# Altium project Metlino.PrjPcb (part 6 of 13)

## Sheet PWR_DC_DC_EXAR.SchDoc: Metlino
size 420 x 297 mm; CheckedBy: P.Kulik,T.Przywozki,W.Ruclo; Author: G.Kasprowicz; CompanyName: WUT ISE; DrawnBy: G.Kasprowicz; Organization: WUT ISE; Address1: PW ISE; Address2: Nowowiejska 15/19 00-665 Warsaw; Address3: gkasprow@gmail.com; DocumentNumber: 22; Revision: 2; SheetNumber: 22; SheetTotal: 29; ModifiedBy: -; CheckedDate: -; Title2: FPGA supply buck converters; DivGrp: WUT ISE; Designer: G.Kasprowicz; ModifiedDate: -; ProjectName: Sensor Box
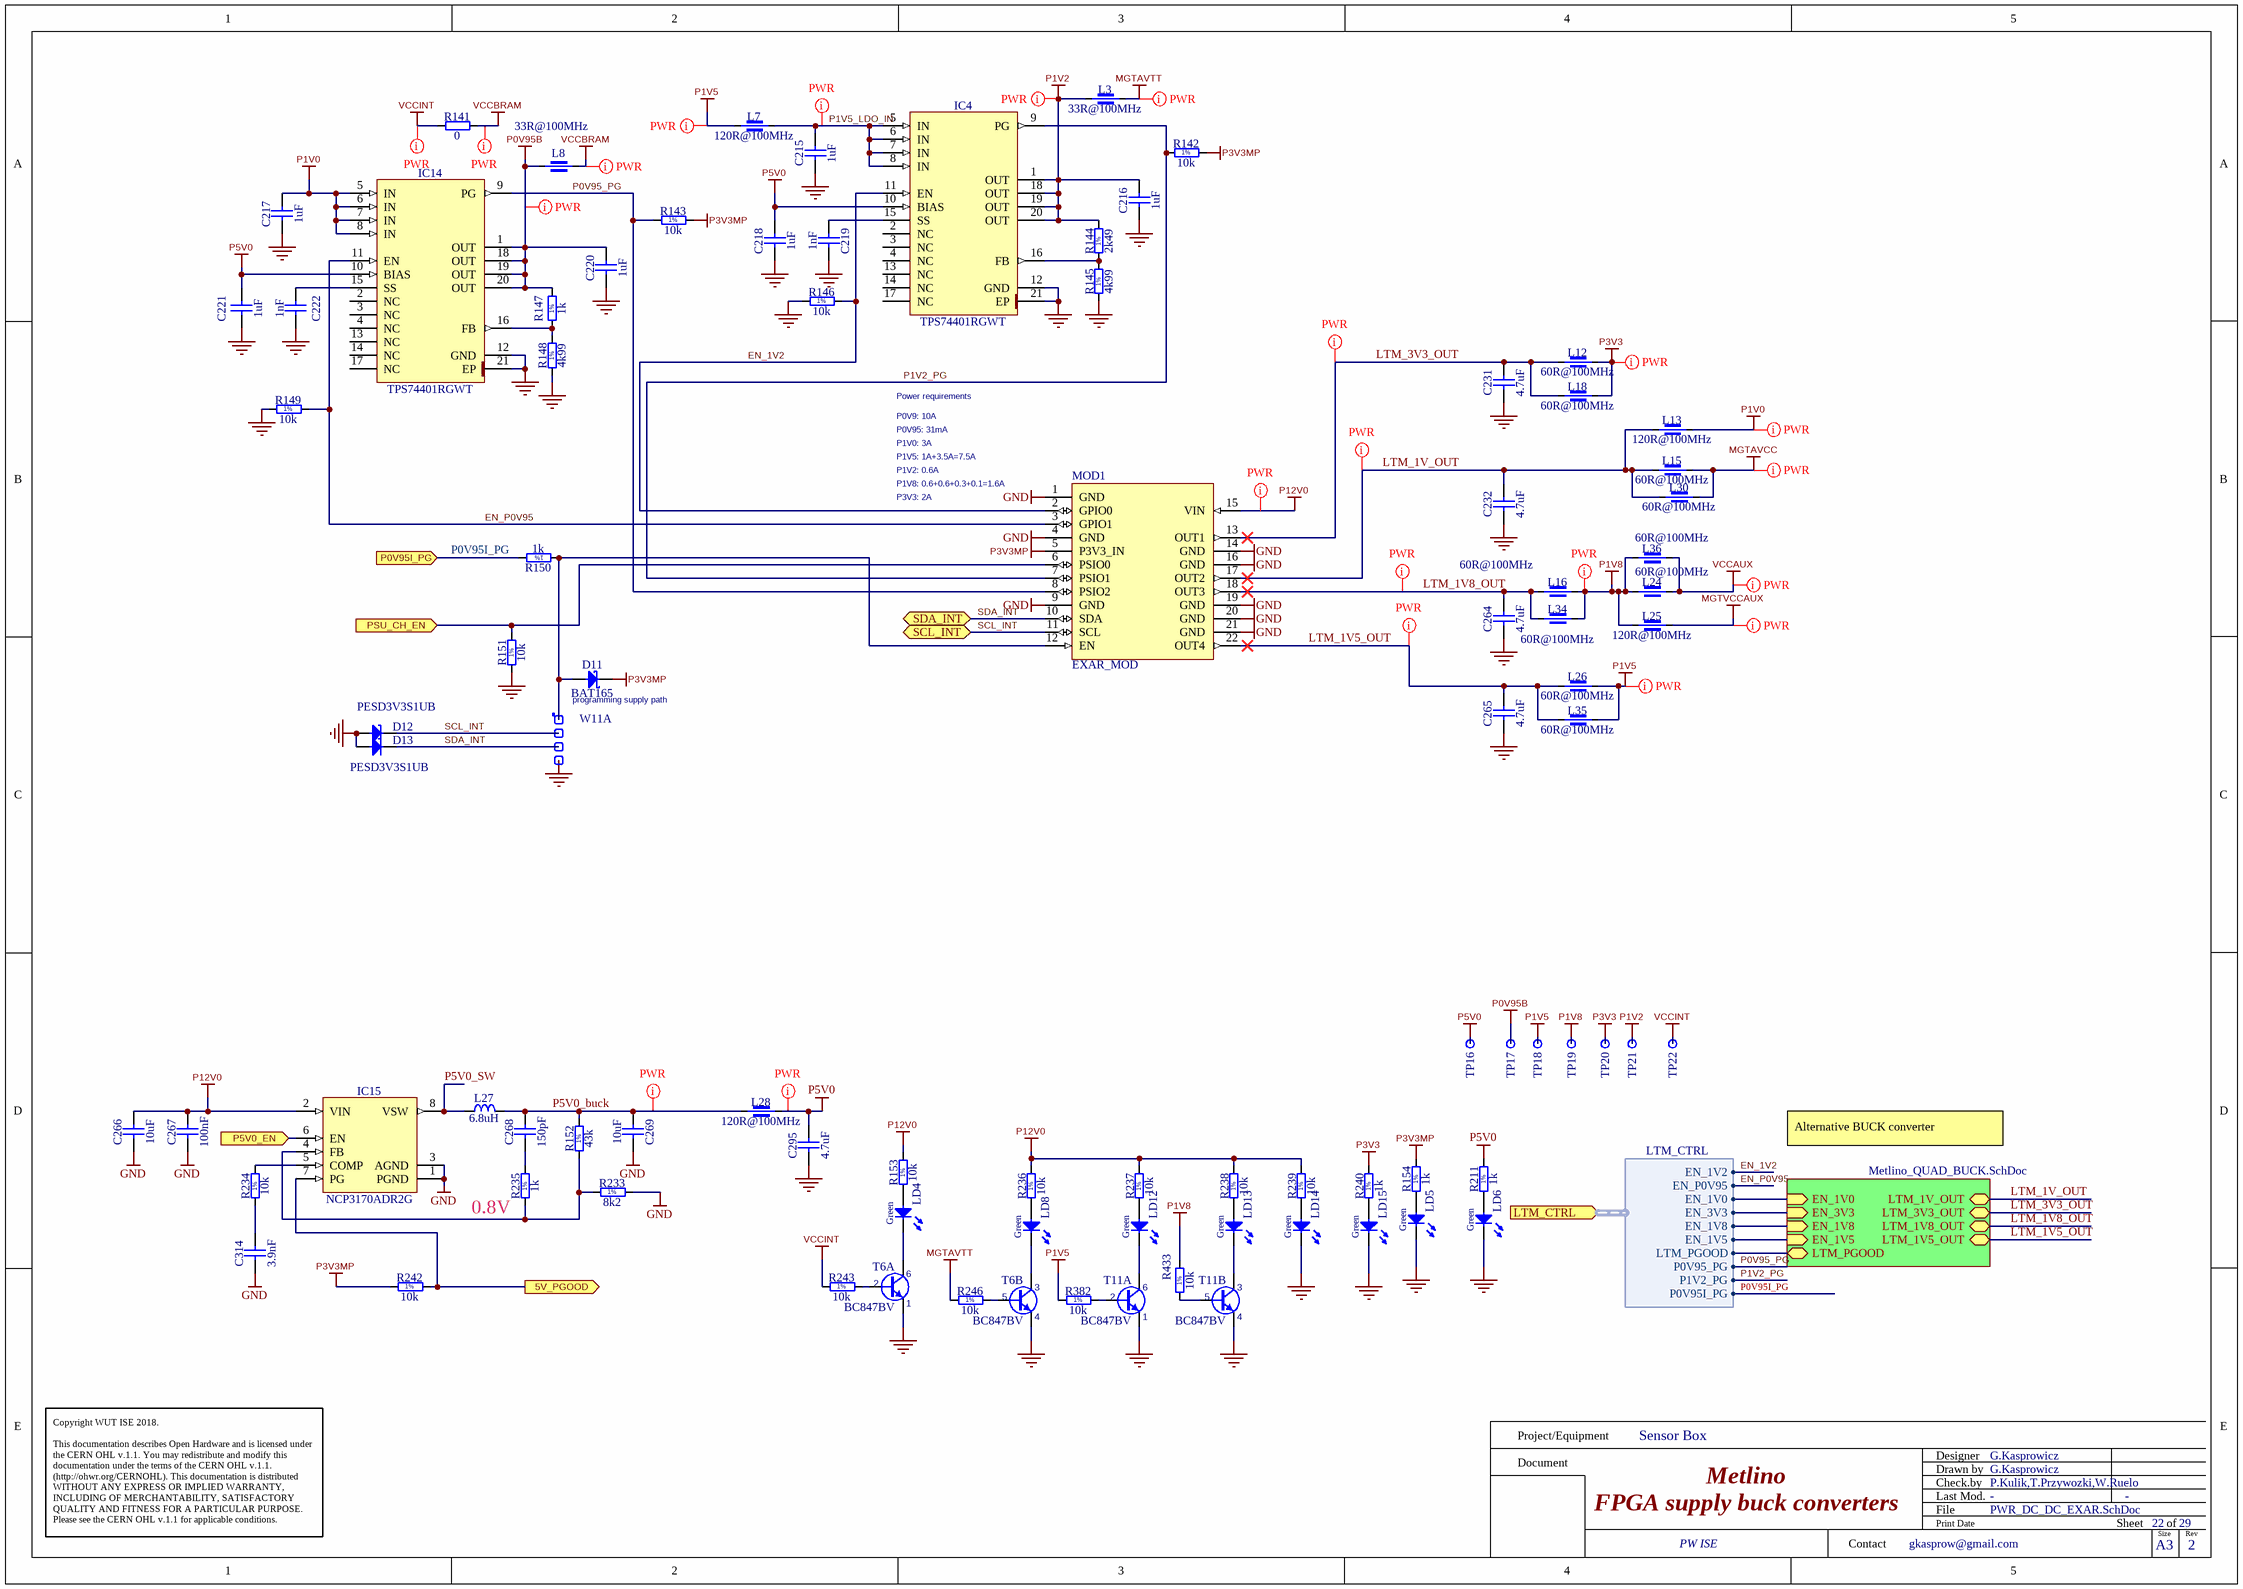
[diagram p10: PWR_DC_DC_EXAR.SchDoc]

### Parts
C215  1uF  [CAPC1005X55N]
C216  1uF  [CAPC1005X55N]
C217  1uF  [CAPC1005X55N]
C218  1uF  [CAPC1005X55N]
C219  1nF  [CAPC1005X55N]
C220  1uF  [CAPC1005X55N]
C221  1uF  [CAPC1005X55N]
C222  1nF  [CAPC1005X55N]
C231  4.7uF  [CAPC1709X95N]
C232  4.7uF  [CAPC1709X95N]
C264  4.7uF  [CAPC1709X95N]
C265  4.7uF  [CAPC1709X95N]
C266  10uF  [CAPC2012X135N]
C267  100nF  [CAPC1005X55N]
C268  150pF  [CAPC1608X87N]
C269  10uF  [CAPC2012X135N]
C295  4.7uF  [CAPC1709X95N]
C314  3.9nF  [CAPC1608X87N]
D11  BAT165  [SOD2512X110N]
D12  PESD3V3S1UB  [SODFL1608X65N]
D13  PESD3V3S1UB  [SODFL1608X65N]
IC4  TPS74401RGWT  [QFN65P500X500X100-21N-S325]
IC14  TPS74401RGWT  [QFN65P500X500X100-21N-S325]
IC15  NCP3170ADR2G  [SOIC127P600X175-8N]
L3  33R@100MHz  [INDC1608X95N]
L7  120R@100MHz  [INDC1608X95N]
L8  33R@100MHz  [INDC1608X95N]
L12  60R@100MHz  [INDC4516X180N]
L13  120R@100MHz  [INDC1608X95N]
L15  60R@100MHz  [INDC4516X180N]
L16  60R@100MHz  [INDC4516X180N]
L18  60R@100MHz  [INDC4516X180N]
L24  60R@100MHz  [INDC4516X180N]
L25  120R@100MHz  [INDC1608X95N]
L26  60R@100MHz  [INDC4516X180N]
L27  6.8uH  [IND_BOURNS_SRU8043]
L28  120R@100MHz  [INDC1608X95N]
L30  60R@100MHz  [INDC4516X180N]
L34  60R@100MHz  [INDC4516X180N]
L35  60R@100MHz  [INDC4516X180N]
L36  60R@100MHz  [INDC4516X180N]
LD4  Green  [LED_KINGBRIGHT_KPH-1608CGCK]
LD5  Green  [LED_KINGBRIGHT_KPH-1608CGCK]
LD6  Green  [LED_KINGBRIGHT_KPH-1608CGCK]
LD8  Green  [LED_KINGBRIGHT_KPH-1608CGCK]
LD12  Green  [LED_KINGBRIGHT_KPH-1608CGCK]
LD13  Green  [LED_KINGBRIGHT_KPH-1608CGCK]
LD14  Green  [LED_KINGBRIGHT_KPH-1608CGCK]
LD15  Green  [LED_KINGBRIGHT_KPH-1608CGCK]
MOD1  EXAR_MOD  [EXAR_MOD]
R141  0  [RESC2012X60N]
R142  10k  [RESC1005X40N]
R143  10k  [RESC1005X40N]
R144  2k49  [RESC1608X55N]
R145  4k99  [RESC1608X55N]
R146  10k  [RESC1005X40N]
R147  1k  [RESC1005X40N]
R148  4k99  [RESC1608X55N]
R149  10k  [RESC1005X40N]
R150  1k  [RESC1005X40N]
R151  10k  [RESC1005X40N]
R152  43k  [RESC1608X55N]
R153  10k  [RESC1005X40N]
R154  1k  [RESC1005X40N]
R211  1k  [RESC1005X40N]
R233  8k2  [RESC1608X55N]
R234  10k  [RESC1005X40N]
R235  1k  [RESC1005X40N]
R236  10k  [RESC1005X40N]
R237  10k  [RESC1005X40N]
R238  10k  [RESC1005X40N]
R239  10k  [RESC1005X40N]
R240  1k  [RESC1005X40N]
R242  10k  [RESC1005X40N]
R243  10k  [RESC1005X40N]
R246  10k  [RESC1005X40N]
R382  10k  [RESC1005X40N]
R433  10k  [RESC1005X40N]
T6  BC847BV  [SOTFL50P160X60-6N]  (parts A,B of 2)
T11  BC847BV  [SOTFL50P160X60-6N]  (parts A,B of 2)
TP16  Test Point  [TPS127]  (value not drawn)
TP17  Test Point  [TPS127]  (value not drawn)
TP18  Test Point  [TPS127]  (value not drawn)
TP19  Test Point  [TPS127]  (value not drawn)
TP20  Test Point  [TPS127]  (value not drawn)
TP21  Test Point  [TPS127]  (value not drawn)
TP22  Test Point  [TPS127]  (value not drawn)
W11  Header 4  [SAMTEC_MTLW-104-07-L-S-250]  (value not drawn)  (parts A,B,C,D of 4)

### Sub-sheets
U_QUAD_BUCK = Metlino_QUAD_BUCK.SchDoc: LTM_1V_OUT (bidir), LTM_1V5_OUT (bidir), EN_1V0 (in), EN_1V5 (in), EN_3V3 (in), EN_1V8 (in), LTM_PGOOD (bidir), LTM_3V3_OUT (bidir), LTM_1V8_OUT (bidir)

### Ports
5V_PGOOD (out), LTM_CTRL (in, harness LTM_CTRL), P0V95I_PG (in), P5V0_EN (in), PSU_CH_EN (in), SCL_INT (bidir), SDA_INT (bidir)

### Harnesses
LTM_CTRL: EN_1V0, EN_3V3, EN_1V8, EN_1V5, LTM_PGOOD, EN_1V2, EN_P0V95, P0V95_PG, P1V2_PG, P0V95I_PG

### Nets
GND: C215.1 C216.1 C217.1 C218.1 C219.2 C220.1 C221.1 C222.2 C231.1 C232.1 C264.1 C265.1 C266.1 C267.1 C269.2 C295.1 C314.1 D12.2(A) D13.2(A) IC4.12(GND) IC4.21(EP) IC14.12(GND) IC14.21(EP) IC15.1(PGND) IC15.3(AGND) LD5.1(C) LD6.1(C) LD14.1(C) LD15.1(C) MOD1.1(GND) MOD1.4(GND) MOD1.9(GND) MOD1.14(GND) MOD1.16(GND) MOD1.19(GND) MOD1.20(GND) MOD1.21(GND) R145.1 R146.1 R148.1 R149.1 R151.1 R233.2 T6.1(E) T6.4(E) T11.1(E) T11.4(E) W11.4
MGTAVCC: L15.2 L30.2
MGTAVTT: L3.2 R246.1
MGTVCCAUX: L25.1
P0V95B: C220.2 IC14.1(OUT) IC14.18(OUT) IC14.19(OUT) IC14.20(OUT) L8.1 R147.2 TP17.1
P1V0: C217.2 IC14.5(IN) IC14.6(IN) IC14.7(IN) IC14.8(IN) L13.1
P1V2: C216.2 IC4.1(OUT) IC4.18(OUT) IC4.19(OUT) IC4.20(OUT) L3.1 R144.2 TP21.1
P1V5: L7.2 L26.2 L35.2 R382.1 TP18.1
P1V8: L16.2 L24.1 L25.2 L34.2 L36.1 R433.2 TP19.1
P3V3: L12.2 L18.2 R240.2 TP20.1
P3V3MP: D11.1(C) MOD1.5(P3V3_IN) R142.2 R143.2 R154.2 R242.1
P5V0: C218.2 C221.2 C295.2 IC4.10(BIAS) IC14.10(BIAS) L28.1 R211.2 TP16.1
P12V0: C266.2 C267.2 IC15.2(VIN) MOD1.15(VIN) R153.2 R236.2 R237.2 R238.2 R239.2
VCCAUX: L24.2 L36.2
VCCBRAM: L8.2 R141.2
VCCINT: R141.1 R243.1 TP22.1
EN_1V0: sheet U_QUAD_BUCK/EN_1V0, port LTM_CTRL.EN_1V0
EN_1V2: IC4.11(EN) MOD1.2(GPIO0) R146.2 ; port LTM_CTRL.EN_1V2
EN_1V5: sheet U_QUAD_BUCK/EN_1V5, port LTM_CTRL.EN_1V5
EN_1V8: sheet U_QUAD_BUCK/EN_1V8, port LTM_CTRL.EN_1V8
EN_3V3: sheet U_QUAD_BUCK/EN_3V3, port LTM_CTRL.EN_3V3
EN_P0V95: IC14.11(EN) MOD1.3(GPIO1) R149.2 ; port LTM_CTRL.EN_P0V95
EN_P5V0: IC15.6(EN) ; port P5V0_EN
EN_PSU_CH: MOD1.6(PSIO0) R151.2 ; port PSU_CH_EN
LTM_1V5_OUT: C265.2 L26.1 L35.1 MOD1.22(OUT4) ; sheet U_QUAD_BUCK/LTM_1V5_OUT
LTM_1V8_OUT: C264.2 L16.1 L34.1 MOD1.18(OUT3) ; sheet U_QUAD_BUCK/LTM_1V8_OUT
LTM_1V_OUT: C232.2 L13.2 L15.1 L30.1 MOD1.17(OUT2) ; sheet U_QUAD_BUCK/LTM_1V_OUT
LTM_3V3_OUT: C231.2 L12.1 L18.1 MOD1.13(OUT1) ; sheet U_QUAD_BUCK/LTM_3V3_OUT
LTM_PGOOD: sheet U_QUAD_BUCK/LTM_PGOOD, port LTM_CTRL.LTM_PGOOD
P0V95_PG: IC14.9(PG) MOD1.8(PSIO2) R143.1 ; port LTM_CTRL.P0V95_PG
P0V95I_PG: R150.2 ; port P0V95I_PG, port LTM_CTRL.P0V95I_PG
P1V2_PG: IC4.9(PG) MOD1.7(PSIO1) R142.1 ; port LTM_CTRL.P1V2_PG
P1V5_LDO_IN: C215.2 IC4.5(IN) IC4.6(IN) IC4.7(IN) IC4.8(IN) L7.1
P5V0_buck: C268.2 C269.1 L27.2 L28.2 R152.2
P5V0_SW: IC15.8(VSW) L27.1
PGOOD_P5V0: IC15.7(PG) R242.2 ; port 5V_PGOOD
SCL_INT: D12.1(C) MOD1.11(SCL) W11.2 ; port SCL_INT  [project net PM_I2C.SCL]
SDA_INT: D13.1(C) MOD1.10(SDA) W11.3 ; port SDA_INT  [project net PM_I2C.SDA]
NetC219_1: C219.1 IC4.15(SS)
NetC222_1: C222.1 IC14.15(SS)
NetC268_1: C268.1 R235.2
NetC314_2: C314.2 R234.1
NetD11_2: D11.2(A) MOD1.12(EN) R150.1 W11.1
NetIC4_16: IC4.16(FB) R144.1 R145.2
NetIC14_16: IC14.16(FB) R147.1 R148.2
NetIC15_4: IC15.4(FB) R152.1 R233.1 R235.1
NetIC15_5: IC15.5(COMP) R234.2
NetLD4_1: LD4.1(C) T6.6(C)
NetLD4_2: LD4.2(A) R153.1
NetLD5_2: LD5.2(A) R154.1
NetLD6_2: LD6.2(A) R211.1
NetLD8_1: LD8.1(C) T6.3(C)
NetLD8_2: LD8.2(A) R236.1
NetLD12_1: LD12.1(C) T11.6(C)
NetLD12_2: LD12.2(A) R237.1
NetLD13_1: LD13.1(C) T11.3(C)
NetLD13_2: LD13.2(A) R238.1
NetLD14_2: LD14.2(A) R239.1
NetLD15_2: LD15.2(A) R240.1
NetR243_2: R243.2 T6.2(B)
NetR246_2: R246.2 T6.5(B)
NetR382_2: R382.2 T11.2(B)
NetR433_1: R433.1 T11.5(B)

Not connected (* = marked no-connect by the designer): IC4 2(NC) 3(NC) 4(NC) 13(NC) 14(NC) 17(NC); IC14 2(NC) 3(NC) 4(NC) 13(NC) 14(NC) 17(NC)

### Layout directives
net class PWR: LTM_1V5_OUT, LTM_1V8_OUT, LTM_1V_OUT, LTM_3V3_OUT, MGTAVCC, MGTAVTT, MGTVCCAUX, P0V95B, P1V0, P1V2, P1V5, P1V5_LDO_IN, P1V8, P3V3, P5V0, P5V0_buck, P12V0, VCCAUX, VCCBRAM, VCCINT

### Notes on the sheet
- Power requirements
- P1V0: 3A
- P0V95: 31mA
- P1V5: 1A+3.5A=7.5A
- P0V9: 10A
- P3V3: 2A
- P1V8: 0.6+0.6+0.3+0.1=1.6A
- P1V2: 0.6A
- programming supply path
- Alternative BUCK converter
- (near R235) 0.8V
- Project/Equipment
- Document
- Designer
- Drawn by
- Check.by
- Copyright WUT ISE 2018.
  This documentation describes Open Hardware and is licensed under the CERN OHL v.1.1. You may redistribute and modify this documentation under the terms of the CERN OHL v.1.1. (http://ohwr.org/CERNOHL). This documentation is distributed WITHOUT ANY EXPRESS OR IMPLIED WARRANTY, INCLUDING OF MERCHANTABILITY, SATISFACTORY QUALITY AND FITNESS FOR A PARTICULAR PURPOSE. Please see the CERN OHL v.1.1 for applicable conditions.
- Contact
- File
- Last Mod.
- Print Date
- Sheet
- Size
- A3
- of
- Rev
- (in symbol R0402_1K_1%_0.0625W_100PPM) 1%
- (in symbol R0402_10K_1%_0.0625W_100PPM) 1%
- (in symbol R0603_2K49_1%_0.063W_50PPM) 1%
- (in symbol R0603_4K99_1%_0.063W_50PPM) 1%
- (in symbol R0603_8K2_1%_0.1W_100PPM) 1%
- (in symbol R0603_43K_1%_0.1W_100PPM) 1%

### Library data of the parts
C215-C218 C220 C221 = CC0402_1UF_16V_10%_X5R: Non-polarised capacitor; Manufacturer: GENERIC; Part Description: SMD Multilayer Chip Ceramic Capacitor; Manufacturer1 Part Number: C1005X5R1C105KT; Tolerance: ±10%; Voltage: 16V; TC: X5R; Manufacturer Part Number: CC0402_1UF_16V_10%_X5R; Part Number: CC0402_1UF_16V_10%_X5R; Value: 1uF; Component Kind: Standard; Component Type: Standard; Pin Count: 2; Status: Preferred; Case: 0402; Mounted: Yes; Socket: No; SMD: Yes; Sense: No; Manufacturer1 Example: TDK; Manufacturer1 ComponentHeight: 0.55mm; HelpURL: \\cern.ch\dfs\Applications\Altium\Datasheets\CC0402_X5R_TDK_C.pdf; Author: CERN DEM JLC; CreateDate: 25.10.2012; LatestRevisionDate: 25.10.2012
C219 C222 = CC0402_1NF_50V_10%_X7R: Non-polarised capacitor; Manufacturer: GENERIC; Part Description: SMD Multilayer Chip Ceramic Capacitor; Manufacturer1 Part Number: 223858715623; Tolerance: ±10%; Voltage: 50V; TC: X7R; Manufacturer Part Number: CC0402_1NF_50V_10%_X7R; Part Number: CC0402_1NF_50V_10%_X7R; Value: 1nF; Component Kind: Standard; Component Type: Standard; Pin Count: 2; Status: Not Recommended; Case: 0402; Mounted: Yes; Socket: No; SMD: Yes; Sense: No; Manufacturer1 Example: PHYCOMP; Manufacturer1 ComponentHeight: 0.55mm; HelpURL: \\cern.ch\dfs\Applications\Altium\Datasheets\CC0402_X7R_PHYCOMP.pdf; Author: CERN DEM JLC; CreateDate: 03.12.2007; LatestRevisionDate: 03.12.2007
C231 C232 C264 C265 C295 = CC0603_4.7UF_16V_10%_X5R: Non-polarised capacitor; Manufacturer: GENERIC; Part Description: SMD Multilayer Chip Ceramic Capacitor; Manufacturer1 Part Number: EMK107ABJ475KA-T; Tolerance: ±10%; Voltage: 16V; TC: X5R; Manufacturer Part Number: CC0603_4.7UF_16V_10%_X5R; Part Number: CC0603_4.7UF_16V_10%_X5R; Value: 4.7uF; Component Kind: Standard; Component Type: Standard; Pin Count: 2; Status: None; Case: 0603; Mounted: Yes; Socket: No; SMD: Yes; Sense: No; Manufacturer1 Example: TAIYO YUDEN; Manufacturer1 ComponentHeight: 0.95mm; HelpURL: \\cern.ch\dfs\Applications\Altium\Datasheets\CC0603_X7R_TAIYO-YUDEN_HIGH-VALUE.pdf; Author: CERN DEM JLC; CreateDate: 16.12.2013; LatestRevisionDate: 16.09.2014
C266 C269 = CC0805_10UF_16V_10%_X5R: Non-polarised capacitor; Part Description: SMD Multilayer Chip Ceramic Capacitor; Manufacturer: GENERIC; Manufacturer1 Part Number: C0805C106K4PAC; Voltage: 16V; TC: X5R; Tolerance: ±10%; Part Number: CC0805_10UF_16V_10%_X5R; Component Kind: Standard; Component Type: Standard; Pin Count: 2; Value: 10uF; Status: Preferred; Manufacturer Part Number: CC0805_10UF_16V_10%_X5R; Case: 0805; Mounted: Yes; Socket: No; SMD: Yes; Sense: No; Manufacturer1 Example: KEMET; Manufacturer1 ComponentHeight: 1.4mm; HelpURL: \\cern.ch\dfs\Applications\Altium\Datasheets\CC1206_X5R_KEMET.pdf; Author: CERN DEM JLC; CreateDate: 03.12.2007; LatestRevisionDate: 03.12.2007
C267 = CC0402_100NF_16V_10%_X5R: Non-polarised capacitor; Part Description: SMD Multilayer Chip Ceramic Capacitor; Manufacturer: GENERIC; Manufacturer1 Part Number: GRM155R61C104KA88D; Voltage: 16V; TC: X5R; Tolerance: ±10%; Part Number: CC0402_100NF_16V_10%_X5R; Component Kind: Standard; Component Type: Standard; Pin Count: 2; Value: 100nF; Status: None; Manufacturer Part Number: CC0402_100NF_16V_10%_X5R; Case: 0402; Mounted: Yes; Socket: No; SMD: Yes; Sense: No; Manufacturer1 Example: MURATA; Manufacturer1 ComponentHeight: 0.55mm; HelpURL: \\cern.ch\dfs\Applications\Altium\Datasheets\CC0402_X5R_MURATA_GRM.pdf; Author: CERN DEM JLC; CreateDate: 10.12.2013; LatestRevisionDate: 10.12.2013
C268 = CC0603_150PF_50V_1%_NP0: Non-polarised capacitor; Part Description: SMD Multilayer Chip Ceramic Capacitor; Manufacturer: GENERIC; Manufacturer1 Part Number: CC0603FRNPO9BN151; Voltage: 50V; TC: C0G/NP0; Tolerance: ±1%; Part Number: CC0603_150PF_50V_1%_NP0; Component Kind: Standard; Component Type: Standard; Pin Count: 2; Value: 150pF; Status: None; Manufacturer Part Number: CC0603_150PF_50V_1%_NP0; Case: 0603; Mounted: Yes; Socket: No; SMD: Yes; Sense: No; Manufacturer1 Example: PHYCOMP; Manufacturer1 ComponentHeight: 0.7mm; HelpURL: \\cern.ch\dfs\Applications\Altium\Datasheets\CC0805_NP0_PHYCOMP_16VTO50V.pdf; Author: CERN DEM MR; CreateDate: 17.02.2016; LatestRevisionDate: 17.02.2016
C314 = CC0603_3.9NF_50V_5%_X7R: Non-polarised capacitor; Part Description: SMD Multilayer Chip Ceramic Capacitor; Manufacturer: GENERIC; Manufacturer1 Part Number: 223858615631; Voltage: 50V; TC: X7R; Tolerance: ±5%; Part Number: CC0603_3.9NF_50V_5%_X7R; Component Kind: Standard; Component Type: Standard; Pin Count: 2; Value: 3.9nF; Status: Preferred; Manufacturer Part Number: CC0603_3.9NF_50V_5%_X7R; Case: 0603; Mounted: Yes; Socket: No; SMD: Yes; Sense: No; Manufacturer1 Example: PHYCOMP; Manufacturer1 ComponentHeight: 0.87mm; HelpURL: \\cern.ch\dfs\Applications\Altium\Datasheets\CC0603_X7R_PHYCOMP.pdf; Author: CERN DEM JLC; CreateDate: 03.12.2007; LatestRevisionDate: 03.12.2007
D11 = BAT165: Schottky Diode; Manufacturer: INFINEON; Part Description: Medium Power AF Schottky Diode; Voltage: 40V; Power: 750mA; PressFit: No; Bonding: No; Manufacturer Part Number: BAT165; PackageDescription: Small Outline Diode (SOD-323), 1.70mm W X 1.25mm L X 1.10mm H body,  IPC Medium Density; Part Number: BAT165; Component Kind: Standard; Component Type: Standard; Device: BAT165; Pin Count: 2; Case: SOD323; Mounted: Yes; Socket: No; SMD: Yes; Sense: No; ComponentHeight: 1.1mm; HelpURL: \\cern.ch\dfs\Applications\Altium\Datasheets\BAT165.pdf; Author: CERN DEM JLC; CreateDate: 12.11.2014; LatestRevisionDate: 12.11.2014
D12 D13 = PESD3V3S1UB: ESD protection diode; Manufacturer: NXP SEMICONDUCTORS; Part Description: ESD protection diode (23kV); Voltage: 3V3; Power: 330W; PressFit: No; Bonding: No; Manufacturer Part Number: PESD3V3S1UB; PackageDescription: Ultra Small Outline Diode Flat Lead (SOD-523), Body; 1.2mm L X 0.8mm W X 0.65mm H, IPC Medium Density; Part Number: PESD3V3S1UB; Component Kind: Standard; Component Type: Standard; Device: PESD3V3S1UB; Pin Count: 2; Case: SOD523; Mounted: Yes; Socket: No; SMD: Yes; Sense: No; ComponentHeight: 0.65mm; HelpURL: \\cern.ch\dfs\Applications\Altium\Datasheets\PESD3V3S1UB.pdf; Author: CERN DEM JLC; CreateDate: 29.11.2012; LatestRevisionDate: 29.11.2012
IC4 IC14 = TPS74401RGWT: Single Output LDO, 3.0A, Adj.(0.8 to 3.3V), Fast Transient Response, Programmable SoftStart; Manufacturer: TEXAS INSTRUMENTS; PressFit: No; Bonding: No; Manufacturer Part Number: TPS74401RGWT; PackageDescription: QFN, 0.65mm pitch,square; 20 pin, 5mm X 5mm X 1mm H body (w/thermal tab 3.25 X 3.25mm),  IPC Medium Density; Part Description: Single Output LDO, 3.0A, Adj.(0.8 to 3.3V), Fast Transient Response, Programmable SoftStart; Part Number: TPS74401RGWT; Component Kind: Standard; Component Type: Standard; Device: TPS74401RGWT; Pin Count: 21; Case: QFN20; Mounted: Yes; Socket: No; SMD: Yes; Sense: No; ComponentHeight: 1mm; HelpURL: \\cern.ch\dfs\Applications\Altium\Datasheets\TPS74401RGWT.pdf; Author: CERN DEM JLC; CreateDate: 02.02.2010; LatestRevisionDate: 02.02.2010
IC15 = NCP3170ADR2G: Synchronous PWM Switching Converter; Manufacturer: ON SEMICONDUCTOR; PressFit: No; Bonding: No; Part Number: NCP3170ADR2G; Component Kind: Standard; Component Type: Standard; Device: NCP3170ADR2G; PackageDescription: SOIC 8, Pitch 1.27mm - Body 4x5mm, IPC Medium Density; Part Description: Synchronous PWM Switching Converter; Manufacturer Part Number: NCP3170ADR2G; Pin Count: 8; Case: SOIC8; Mounted: Yes; Socket: No; SMD: Yes; Sense: No; ComponentHeight: 1.75mm; Author: CERN DEM MR; HelpURL: \\cern.ch\dfs\Applications\Altium\Datasheets\NCP3170ADR2G.pdf; CreateDate: 30.05.2016; LatestRevisionDate: 30.05.2016
L3 L8 = IND0603_MURATA_BLM18PG330SN1D: Manufacturer: MURATA; Part Description: SMD EMIFIL Chip Ferrite Bead; Tolerance: ±25%; Power: 3A; Resistance: 0.025R; Manufacturer Part Number: BLM18PG330SN1D; Part Number: IND0603_MURATA_BLM18PG330SN1D; Value: 33R@100MHz; Component Kind: Standard; Component Type: Standard; Pin Count: 2; Status: None; Case: 0603; Mounted: Yes; Socket: No; SMD: Yes; Sense: No; ComponentHeight: 0.95mm; HelpURL: \\cern.ch\dfs\Applications\Altium\Datasheets\IND0603_MURATA_BLM18P.pdf; Author: CERN DEM JMW; CreateDate: 19.02.2014; LatestRevisionDate: 25.10.2018
L7 L13 L25 L28 = IND0603_MURATA_BLM18PG121SN1D: Manufacturer: MURATA; Part Description: SMD EMIFIL Chip Ferrite Bead; Power: 2A; Resistance: 0.05R; Manufacturer Part Number: BLM18PG121SN1D; Part Number: IND0603_MURATA_BLM18PG121SN1D; Value: 120R@100MHz; Component Kind: Standard; Component Type: Standard; Pin Count: 2; Status: None; Case: 0603; Mounted: Yes; Socket: No; SMD: Yes; Sense: No; ComponentHeight: 0.95mm; HelpURL: \\cern.ch\dfs\Applications\Altium\Datasheets\IND0603_MURATA_BLM18P.pdf; Author: CERN DEM BC; CreateDate: 27.07.2015; LatestRevisionDate: 25.10.2018
L12 L15 L16 L18 L24 L26 L30 L34-L36 = IND1806_MURATA_BLM41PG600SN1L: Manufacturer: MURATA; Part Description: SMD EMI Suppression Chip Ferrite Bead (BLM41P Series); Power: 6A; Resistance: 0.01R; Manufacturer Part Number: BLM41PG600SN1L; Part Number: IND1806_MURATA_BLM41PG600SN1L; Value: 60R@100MHz; Component Kind: Standard; Component Type: Standard; Pin Count: 2; Status: None; Case: 1806; Mounted: Yes; Socket: No; SMD: Yes; Sense: No; ComponentHeight: 1.8mm; HelpURL: \\cern.ch\dfs\Applications\Altium\Datasheets\IND1806_MURATA_BLM41P.pdf; Author: CERN DEM JLC; CreateDate: 02.12.2009; LatestRevisionDate: 02.12.2009
L27 = IND_6.8UH_30%_BOURNS_SRU8043: Inductor; Part Description: Shielded SMD Power Inductor; Manufacturer: BOURNS; Manufacturer Part Number: SRU8043-6R8Y; Power: 3.8A; Resistance: 0.0224R; Tolerance: ±30%; Part Number: IND_6.8UH_30%_BOURNS_SRU8043; Component Kind: Standard; Component Type: Standard; Pin Count: 2; Value: 6.8uH; Status: None; Mounted: Yes; Socket: No; SMD: Yes; Sense: No; ComponentHeight: 4.6mm; HelpURL: \\cern.ch\dfs\Applications\Altium\Datasheets\IND_BOURNS_SRU8043.pdf; Author: CERN DEM JMW; CreateDate: 06.08.2015; LatestRevisionDate: 06.08.2015
LD4-LD6 LD8 LD12-LD15 = LED_KINGBRIGHT_KPH-1608CGCK: LED Green 1C 2A; Part Description: SMD Green LED, Case 1.6mmX0.8mm(0603), 0.65mm Thickness; PressFit: No; Bonding: No; Manufacturer Part Number: KPH-1608CGCK; Manufacturer: KINGBRIGHT; PackageDescription: SMT Green LED, Case 0603, Body L 1.6 x W 0.8mm H 0.65mm; Part Number: LED_KINGBRIGHT_KPH-1608CGCK; Component Kind: Standard; Component Type: Standard; Color: Green; Pin Count: 2; Mounted: Yes; Socket: No; SMD: Yes; Sense: No; ComponentHeight: 0.65mm; HelpURL: \\cern.ch\dfs\Applications\Altium\Datasheets\LED_KINGBRIGHT_KPH-1608CGCK.pdf; Author: CERN DEM JLC; CreateDate: 03.07.2017; LatestRevisionDate: 03.07.2017
MOD1 = DC/DC_EXAR_MOD: 4 channel PCB module based on XRP7724ILB-F
R141 = R0805_0R_JUMPER: Resistor; Part Description: 2A (0.05R Max DC Resistance) Zero Ohm Jumper; Manufacturer: GENERIC; Manufacturer1 Part Number: NRC10Z0; PressFit: No; Part Number: R0805_0R_JUMPER; Component Kind: Standard; Component Type: Standard; Pin Count: 2; Value: 0; Status: Preferred; Manufacturer Part Number: R0805_0R_JUMPER; Case: 0805; Mounted: Yes; Sense: No; Socket: No; SMD: Yes; Manufacturer1 Example: NIC COMPONENT; Manufacturer1 ComponentHeight: 0.6mm; HelpURL: \\cern.ch\dfs\Applications\Altium\Datasheets\R0805_NIC_NRC.pdf; Author: CERN DEM JLC; CreateDate: 03.12.2007; LatestRevisionDate: 13.03.2008
R142 R143 R146 R149 R151 R153 R236-R239 R242 R243 R246 R382 R433 = R0402_10K_1%_0.0625W_100PPM: Resistor - 1%; Manufacturer: GENERIC; Part Description: General Purpose Thick Film Chip Resistor; Manufacturer1 Part Number: 232270671003L; TC: ±100ppm/°C; PressFit: No; Manufacturer Part Number: R0402_10K_1%_0.0625W_100PPM; Part Number: R0402_10K_1%_0.0625W_100PPM; Tolerance: ±1%; Value: 10k; Component Kind: Standard; Component Type: Standard; Pin Count: 2; Status: Not Recommended; Power: 0.0625W; Case: 0402; Mounted: Yes; Sense: No; Socket: No; SMD: Yes; Manufacturer1 Example: YAGEO PHYCOMP; Manufacturer1 ComponentHeight: 0.4mm; HelpURL: \\cern.ch\dfs\Applications\Altium\Datasheets\R0402_Phycomp_RC0402.pdf; Author: CERN DEM JLC; CreateDate: 03.12.2007; LatestRevisionDate: 17.10.2012
R144 = R0603_2K49_1%_0.063W_50PPM: Resistor - 1%; Manufacturer: GENERIC; Part Description: General Purpose Thick Film Chip Resistor; Manufacturer1 Part Number: CPF0603F2K49C1; Power: 0.1W; TC: ±50ppm/°C; PressFit: No; Manufacturer Part Number: R0603_2K49_1%_0.063W_50PPM; Part Number: R0603_2K49_1%_0.063W_50PPM; Tolerance: ±1%; Value: 2k49; Component Kind: Standard; Component Type: Standard; Pin Count: 2; Status: None; Case: 0603; Mounted: Yes; Sense: No; Socket: No; SMD: Yes; Manufacturer1 Example: TYCO NEOHM; Manufacturer1 ComponentHeight: 0.55mm; HelpURL: \\cern.ch\dfs\Applications\Altium\Datasheets\R0603_TYCO_CPF.pdf; Author: CERN DEM JLC; CreateDate: 20.05.2010; LatestRevisionDate: 20.05.2010
R145 R148 = R0603_4K99_1%_0.063W_50PPM: Resistor - 1%; Manufacturer: GENERIC; Part Description: General Purpose Thick Film Chip Resistor; Manufacturer1 Part Number: CPF0603F4K99C1; Power: 0.1W; TC: ±50ppm/°C; PressFit: No; Manufacturer Part Number: R0603_4K99_1%_0.063W_50PPM; Part Number: R0603_4K99_1%_0.063W_50PPM; Tolerance: ±1%; Value: 4k99; Component Kind: Standard; Component Type: Standard; Pin Count: 2; Status: None; Case: 0603; Mounted: Yes; Sense: No; Socket: No; SMD: Yes; Manufacturer1 Example: TYCO NEOHM; Manufacturer1 ComponentHeight: 0.55mm; HelpURL: \\cern.ch\dfs\Applications\Altium\Datasheets\R0603_TYCO_CPF.pdf; Author: CERN DEM JLC; CreateDate: 20.05.2010; LatestRevisionDate: 20.05.2010
R147 R150 R154 R211 R240 = R0402_1K_1%_0.0625W_100PPM: Resistor - 1%; Manufacturer: GENERIC; Part Description: General Purpose Thick Film Chip Resistor; Manufacturer1 Part Number: 232270671002L; TC: ±100ppm/°C; PressFit: No; Manufacturer Part Number: R0402_1K_1%_0.0625W_100PPM; Part Number: R0402_1K_1%_0.0625W_100PPM; Tolerance: ±1%; Value: 1k; Component Kind: Standard; Component Type: Standard; Pin Count: 2; Status: Not Recommended; Power: 0.0625W; Case: 0402; Mounted: Yes; Sense: No; Socket: No; SMD: Yes; Manufacturer1 Example: YAGEO PHYCOMP; Manufacturer1 ComponentHeight: 0.4mm; HelpURL: \\cern.ch\dfs\Applications\Altium\Datasheets\R0402_Phycomp_RC0402.pdf; Author: CERN DEM JLC; CreateDate: 03.12.2007; LatestRevisionDate: 17.10.2012
R152 = R0603_43K_1%_0.1W_100PPM: Resistor - 1%; Part Description: General Purpose Thick Film Chip Resistor; Manufacturer: GENERIC; Manufacturer1 Part Number: NRC06F4302TRF; Power: 0.1W; TC: ±100ppm/°C; PressFit: No; Part Number: R0603_43K_1%_0.1W_100PPM; Component Kind: Standard; Component Type: Standard; Pin Count: 2; Value: 43k; Status: Preferred; Tolerance: ±1%; Manufacturer Part Number: R0603_43K_1%_0.1W_100PPM; Case: 0603; Mounted: Yes; Sense: No; Socket: No; SMD: Yes; Manufacturer1 Example: NIC COMPONENT; Manufacturer1 ComponentHeight: 0.55mm; HelpURL: \\cern.ch\dfs\Applications\Altium\Datasheets\R0603_NIC_NRC.pdf; Author: CERN DEM JLC; CreateDate: 03.12.2007; LatestRevisionDate: 13.03.2008
R233 = R0603_8K2_1%_0.1W_100PPM: Resistor - 1%; Part Description: General Purpose Thick Film Chip Resistor; Manufacturer: GENERIC; Manufacturer1 Part Number: NRC06F8201TRF; Power: 0.1W; TC: ±100ppm/°C; PressFit: No; Part Number: R0603_8K2_1%_0.1W_100PPM; Component Kind: Standard; Component Type: Standard; Pin Count: 2; Value: 8k2; Status: Preferred; Tolerance: ±1%; Manufacturer Part Number: R0603_8K2_1%_0.1W_100PPM; Case: 0603; Mounted: Yes; Sense: No; Socket: No; SMD: Yes; Manufacturer1 Example: NIC COMPONENT; Manufacturer1 ComponentHeight: 0.55mm; HelpURL: \\cern.ch\dfs\Applications\Altium\Datasheets\R0603_NIC_NRC.pdf; Author: CERN DEM JLC; CreateDate: 03.12.2007; LatestRevisionDate: 13.03.2008
R234 = R0402_10K_1%_0.0625W_100PPM: Resistor - 1%; Part Description: General Purpose Thick Film Chip Resistor; Manufacturer: GENERIC; Manufacturer1 Part Number: 232270671003L; TC: ±100ppm/°C; PressFit: No; Part Number: R0402_10K_1%_0.0625W_100PPM; Component Kind: Standard; Component Type: Standard; Pin Count: 2; Value: 10k; Status: Not Recommended; Power: 0.0625W; Tolerance: ±1%; Manufacturer Part Number: R0402_10K_1%_0.0625W_100PPM; Case: 0402; Mounted: Yes; Sense: No; Socket: No; SMD: Yes; Manufacturer1 Example: YAGEO PHYCOMP; Manufacturer1 ComponentHeight: 0.4mm; HelpURL: \\cern.ch\dfs\Applications\Altium\Datasheets\R0402_Phycomp_RC0402.pdf; Author: CERN DEM JLC; CreateDate: 03.12.2007; LatestRevisionDate: 17.10.2012
R235 = R0402_1K_1%_0.0625W_100PPM: Resistor - 1%; Part Description: General Purpose Thick Film Chip Resistor; Manufacturer: GENERIC; Manufacturer1 Part Number: 232270671002L; TC: ±100ppm/°C; PressFit: No; Part Number: R0402_1K_1%_0.0625W_100PPM; Component Kind: Standard; Component Type: Standard; Pin Count: 2; Value: 1k; Status: Not Recommended; Power: 0.0625W; Tolerance: ±1%; Manufacturer Part Number: R0402_1K_1%_0.0625W_100PPM; Case: 0402; Mounted: Yes; Sense: No; Socket: No; SMD: Yes; Manufacturer1 Example: YAGEO PHYCOMP; Manufacturer1 ComponentHeight: 0.4mm; HelpURL: \\cern.ch\dfs\Applications\Altium\Datasheets\R0402_Phycomp_RC0402.pdf; Author: CERN DEM JLC; CreateDate: 03.12.2007; LatestRevisionDate: 17.10.2012
T6 T11 = BC847BV: 45V, 100mA NPN General Purpose Double Transistor; Manufacturer: NXP SEMICONDUCTORS; Part Description: 45V 100mA NPN General Purpose Double Transistor; PressFit: No; Bonding: No; Manufacturer Part Number: BC847BV; PackageDescription: SOTFL (SOT666), 0.50mm, Pitch; 6 Pin, 1.20mm W X 1.60mm L X 0.60mm H Body, IPC Medium Density; Part Number: BC847BV; Component Kind: Standard; Component Type: Standard; Device: BC847BV; Pin Count: 6; Case: SOT666; Mounted: Yes; Socket: No; SMD: Yes; Sense: No; ComponentHeight: 0.6mm; HelpURL: \\cern.ch\dfs\Applications\Altium\Datasheets\BC847BV.pdf; Author: CERN DEM JLC; CreateDate: 01.12.2011; LatestRevisionDate: 01.12.2011
TP16-TP22 = SMD_PAD_1.27X1.27MM: Part Description: 1.27mm x 1.27mm PCB Copper Area (SMD Test Point); Mounted: No; Part Number: SMD_PAD_1.27X1.27MM; Component Kind: Standard (No BOM); Component Type: Standard (No BOM); Pin Count: 1; Family: Test Point; Socket: No; SMD: Yes; Sense: No; Status: None; ComponentHeight: 0mm; HelpURL: Undefined; Author: CERN DEM JLC; CreateDate: 12.01.2008; LatestRevisionDate: 12.01.2008; PackageDescription: 1.27mm x 1.27mm PCB Copper Area (SMD Test Point)
W11 = SAMTEC_MTLW-104-07-L-S-250: 4 Mini Wire-Wrap Contact Strip Header; Manufacturer: SAMTEC; Part Description: 4 Contacts, Pitch 2.54mm, Single Row Through Mount Straight Header (Post Lead = 6.35mm, Tail Lead 3.05mm, Insulator 1.52mm); PressFit: No; Manufacturer Part Number: MTLW-104-07-L-S-250; Part Number: SAMTEC_MTLW-104-07-L-S-250; Component Kind: Standard; Component Type: Standard; Pin Count: 4; Family: Header 4; Mounted: Yes; Socket: No; Sense: No; SMD: No; Status: None; ComponentHeight: 7.87mm; HelpURL: \\cern.ch\dfs\Applications\Altium\Datasheets\SAMTEC_MTLW-104-07-L-S-250.pdf; Author: CERN DEM JLC; CreateDate: 13.12.2012; LatestRevisionDate: 13.12.2012

## Sheet Metlino_QUAD_BUCK.SchDoc: Sayma AMC
size 420 x 297 mm; CheckedBy: P.Kulik,T.Przywozki,W.Ruclo; Author: G.Kasprowicz; CompanyName: WUT ISE; DrawnBy: G.Kasprowicz; Organization: WUT ISE; Address1: PW ISE; Address2: Nowowiejska 15/19 00-665 Warsaw; Address3: gkasprow@gmail.com; DocumentNumber: 15; Revision: 2; SheetNumber: 15; SheetTotal: 29; ModifiedBy: -; CheckedDate: -; Title2: Quad buck converter; DivGrp: WUT ISE; Designer: G.Kasprowicz; ModifiedDate: -; ProjectName: Sensor Box
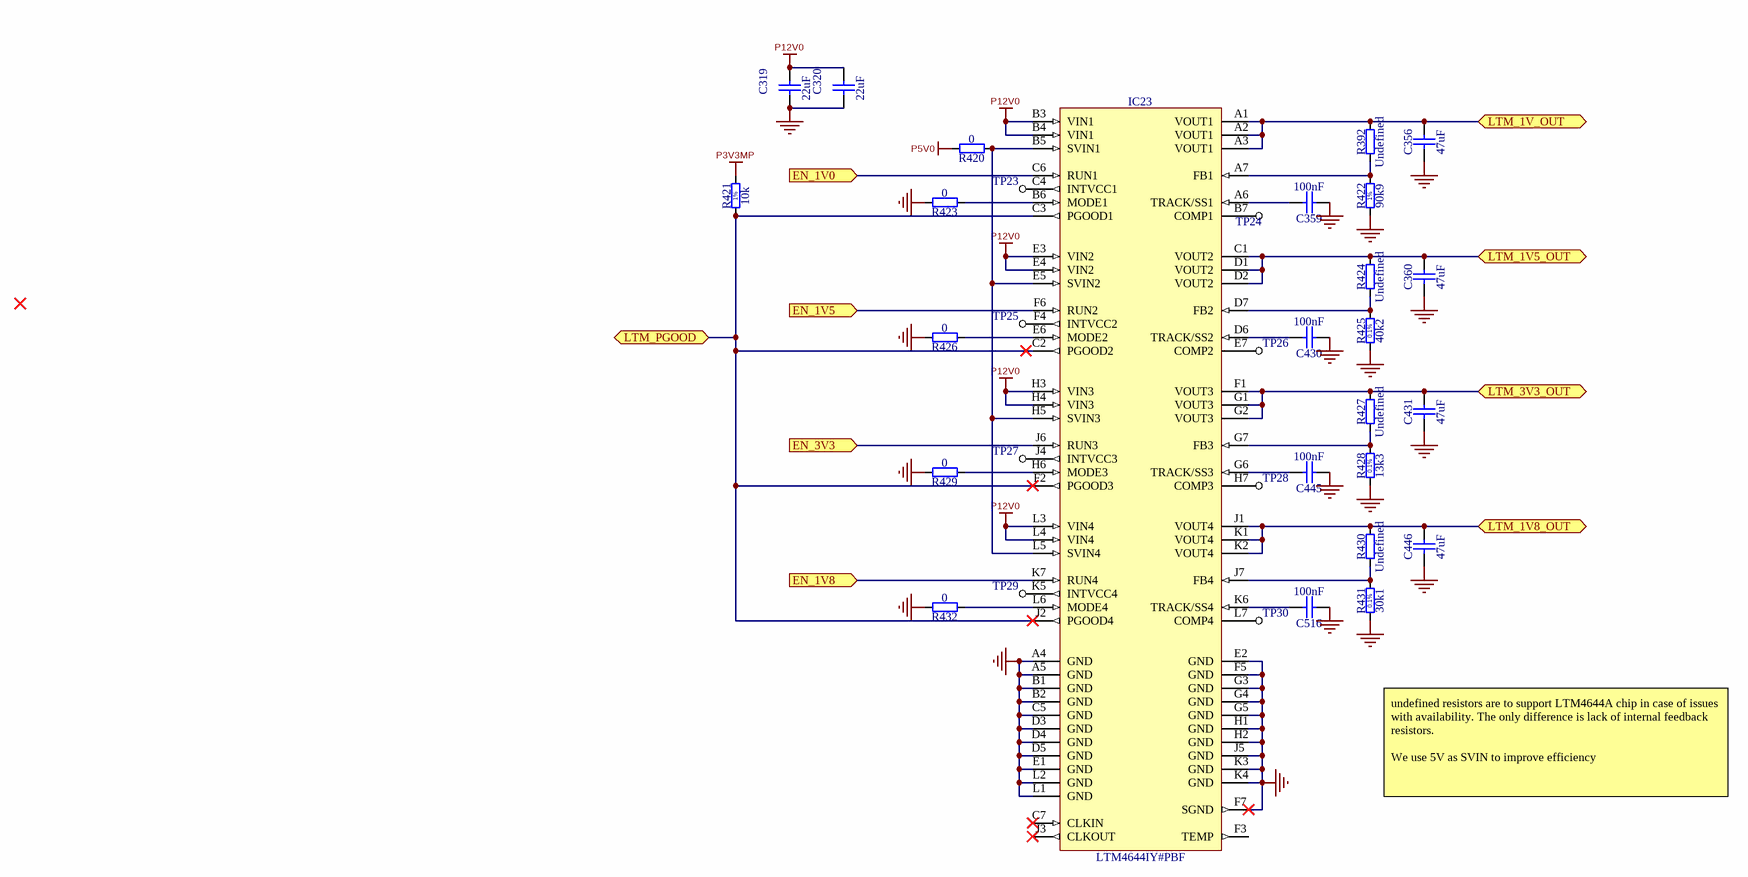
[diagram p11: Metlino_QUAD_BUCK.SchDoc]

### Parts
C319  22uF  [CAPC2012X135N]
C320  22uF  [CAPC2012X135N]
C356  47uF  [CAPC2012X140N]
C359  100nF  [CAPC1005X55N]
C360  47uF  [CAPC2012X140N]
C430  100nF  [CAPC1005X55N]
C431  47uF  [CAPC2012X140N]
C445  100nF  [CAPC1005X55N]
C446  47uF  [CAPC2012X140N]
C516  100nF  [CAPC1005X55N]
IC23  LTM4644IY#PBF  [BGA77C127P7X11_900X1500X521]
R392  Undefined  [RESC1608X55N]
R420  0  [RESC1005X40N]
R421  10k  [RESC1005X40N]
R422  90k9  [RESC1608X55N]
R423  0  [RESC1005X40N]
R424  Undefined  [RESC1608X55N]
R425  40k2  [RESC1608X55N]
R426  0  [RESC1005X40N]
R427  Undefined  [RESC1608X55N]
R428  13k3  [RESC1608X55N]
R429  0  [RESC1005X40N]
R430  Undefined  [RESC1608X55N]
R431  30k1  [RESC1608X55N]
R432  0  [RESC1005X40N]
TP23  TP  [TP]  (value not drawn)
TP24  TP  [TP]  (value not drawn)
TP25  TP  [TP]  (value not drawn)
TP26  TP  [TP]  (value not drawn)
TP27  TP  [TP]  (value not drawn)
TP28  TP  [TP]  (value not drawn)
TP29  TP  [TP]  (value not drawn)
TP30  TP  [TP]  (value not drawn)

### Ports
EN_1V0 (in), EN_1V5 (in), EN_1V8 (in), EN_3V3 (in), LTM_1V5_OUT (bidir), LTM_1V8_OUT (bidir), LTM_1V_OUT (bidir), LTM_3V3_OUT (bidir), LTM_PGOOD (bidir)

### Nets
GND: C319.1 C320.1 C356.1 C359.1 C360.1 C430.1 C431.1 C445.1 C446.1 C516.1 IC23.A4(GND) IC23.A5(GND) IC23.B1(GND) IC23.B2(GND) IC23.C5(GND) IC23.D3(GND) IC23.D4(GND) IC23.D5(GND) IC23.E1(GND) IC23.E2(GND) IC23.F5(GND) IC23.F7(SGND) IC23.G3(GND) IC23.G4(GND) IC23.G5(GND) IC23.H1(GND) IC23.H2(GND) IC23.J5(GND) IC23.K3(GND) IC23.K4(GND) IC23.L1(GND) IC23.L2(GND) R422.1 R423.2 R425.1 R426.2 R428.1 R429.2 R431.1 R432.2
P3V3MP: R421.2
P5V0: R420.2
P12V0: C319.2 C320.2 IC23.B3(VIN1) IC23.B4(VIN1) IC23.E3(VIN2) IC23.E4(VIN2) IC23.H3(VIN3) IC23.H4(VIN3) IC23.L3(VIN4) IC23.L4(VIN4)
EN_1V0: IC23.C6(RUN1) ; port EN_1V0
EN_1V5: IC23.F6(RUN2) ; port EN_1V5
EN_1V8: IC23.K7(RUN4) ; port EN_1V8
EN_3V3: IC23.J6(RUN3) ; port EN_3V3
LTM_1V5_OUT: C360.2 IC23.C1(VOUT2) IC23.D1(VOUT2) IC23.D2(VOUT2) R424.2 ; port LTM_1V5_OUT
LTM_1V8_OUT: C446.2 IC23.J1(VOUT4) IC23.K1(VOUT4) IC23.K2(VOUT4) R430.2 ; port LTM_1V8_OUT
LTM_1V_OUT: C356.2 IC23.A1(VOUT1) IC23.A2(VOUT1) IC23.A3(VOUT1) R392.2 ; port LTM_1V_OUT
LTM_3V3_OUT: C431.2 IC23.F1(VOUT3) IC23.G1(VOUT3) IC23.G2(VOUT3) R427.2 ; port LTM_3V3_OUT
LTM_PGOOD: IC23.C2(PGOOD2) IC23.C3(PGOOD1) IC23.F2(PGOOD3) IC23.J2(PGOOD4) R421.1 ; port LTM_PGOOD
NetC359_2: C359.2 IC23.A6(TRACK/SS1)
NetC430_2: C430.2 IC23.D6(TRACK/SS2)
NetC445_2: C445.2 IC23.G6(TRACK/SS3)
NetC516_2: C516.2 IC23.K6(TRACK/SS4)
NetIC23_A7: IC23.A7(FB1) R392.1 R422.2
NetIC23_B5: IC23.B5(SVIN1) IC23.E5(SVIN2) IC23.H5(SVIN3) IC23.L5(SVIN4) R420.1
NetIC23_B6: IC23.B6(MODE1) R423.1
NetIC23_B7: IC23.B7(COMP1) TP24.1
NetIC23_C4: IC23.C4(INTVCC1) TP23.1
NetIC23_D7: IC23.D7(FB2) R424.1 R425.2
NetIC23_E6: IC23.E6(MODE2) R426.1
NetIC23_E7: IC23.E7(COMP2) TP26.1
NetIC23_F4: IC23.F4(INTVCC2) TP25.1
NetIC23_G7: IC23.G7(FB3) R427.1 R428.2
NetIC23_H6: IC23.H6(MODE3) R429.1
NetIC23_H7: IC23.H7(COMP3) TP28.1
NetIC23_J4: IC23.J4(INTVCC3) TP27.1
NetIC23_J7: IC23.J7(FB4) R430.1 R431.2
NetIC23_K5: IC23.K5(INTVCC4) TP29.1
NetIC23_L6: IC23.L6(MODE4) R432.1
NetIC23_L7: IC23.L7(COMP4) TP30.1

Not connected (* = marked no-connect by the designer): IC23 C7(CLKIN)* F3(TEMP) J3(CLKOUT)*

### Notes on the sheet
- undefined resistors are to support LTM4644A chip in case of issues with availability. The only difference is lack of internal feedback resistors.
  We use 5V as SVIN to improve efficiency
- Project/Equipment
- Document
- Designer
- Drawn by
- Check.by
- Copyright WUT ISE 2018.
  This documentation describes Open Hardware and is licensed under the CERN OHL v.1.1. You may redistribute and modify this documentation under the terms of the CERN OHL v.1.1. (http://ohwr.org/CERNOHL). This documentation is distributed WITHOUT ANY EXPRESS OR IMPLIED WARRANTY, INCLUDING OF MERCHANTABILITY, SATISFACTORY QUALITY AND FITNESS FOR A PARTICULAR PURPOSE. Please see the CERN OHL v.1.1 for applicable conditions.
- Contact
- File
- Last Mod.
- Print Date
- Sheet
- Size
- A3
- of
- Rev
- (in symbol R0402_10K_1%_0.0625W_100PPM) 1%
- (in symbol R0603_13K3_0.1%_0.063W_10PPM) 0.1%
- (in symbol R0603_30K1_0.1%_0.063W_10PPM) 0.1%
- (in symbol R0603_40K2_0.1%_0.063W_10PPM) 0.1%
- (in symbol R0603_90K9_1%_0.1W_100PPM) 1%

### Library data of the parts
C319 C320 = CC0805_22UF_16V_10%_X5R: Non-polarised capacitor; Manufacturer: GENERIC; Part Description: SMD Multilayer Chip Ceramic Capacitor; Manufacturer1 Part Number: C2012X5R1C226KT; Tolerance: ±10%; Voltage: 16V; TC: X5R; Manufacturer Part Number: CC0805_22UF_16V_10%_X5R; Part Number: CC0805_22UF_16V_10%_X5R; Value: 22uF; Component Kind: Standard; Component Type: Standard; Pin Count: 2; Status: Preferred; Case: 0805; Mounted: Yes; Socket: No; SMD: Yes; Sense: No; Manufacturer1 Example: TDK; Manufacturer1 ComponentHeight: 1.35mm; HelpURL: \\cern.ch\dfs\Applications\Altium\Datasheets\CC0805_X5R_TDK_C.pdf; Author: CERN DEM JLC; CreateDate: 25.10.2012; LatestRevisionDate: 25.10.2012
C356 C360 C431 C446 = CC0805_47UF_6.3V_20%_X5R: Non-polarised capacitor; Manufacturer: GENERIC; Part Description: SMD Multilayer Chip Ceramic Capacitor; Manufacturer1 Part Number: C0805C476M9PACTU; Tolerance: ±20%; Voltage: 6.3V; TC: X5R; Manufacturer Part Number: CC0805_47UF_6.3V_20%_X5R; Part Number: CC0805_47UF_6.3V_20%_X5R; Value: 47uF; Component Kind: Standard; Component Type: Standard; Pin Count: 2; Status: Preferred; Case: 0805; Mounted: Yes; Socket: No; SMD: Yes; Sense: No; Manufacturer1 Example: KEMET; Manufacturer1 ComponentHeight: 1.4mm; HelpURL: \\cern.ch\dfs\Applications\Altium\Datasheets\CC0805_X5R_KEMET.pdf; Author: CERN DEM JLC; CreateDate: 16.10.2012; LatestRevisionDate: 16.10.2012
C359 C430 C445 C516 = CC0402_100NF_16V_10%_X5R: as C267 on sheet PWR_DC_DC_EXAR; Part Number: CC0402_100NF_16V_10%_X5R; Component Kind: Standard; Component Type: Standard; Pin Count: 2; Value: 100nF; Status: None; Manufacturer Part Number: CC0402_100NF_16V_10%_X5R; Case: 0402; Mounted: Yes; Socket: No; SMD: Yes; Sense: No; Manufacturer1 Example: MURATA; Manufacturer1 ComponentHeight: 0.55mm; HelpURL: \\cern.ch\dfs\Applications\Altium\Datasheets\CC0402_X5R_MURATA_GRM.pdf; Author: CERN DEM JLC; CreateDate: 10.12.2013; LatestRevisionDate: 10.12.2013
IC23 = LTM4644IY#PBF: Quad DC/DC µModule Regulator with Configurable 4A Output Array; Part Description: 4V-14V to 0.6V-5.5V Quad DC/DC uModule (Power Module) Regulator with Configurable 4A Output Array; Manufacturer: LINEAR TECHNOLOGY; PressFit: No; Bonding: No; Part Number: LTM4644IY#PBF; Component Kind: Standard; Component Type: Standard; Device: LTM4644IY#PBF; PackageDescription: BGA, 1.27mm Pitch, Rect.; 77 Pin, 7 Columns X 11 Rows, 9.00mm X 15.00mm X 5.21mm H; Manufacturer Part Number: LTM4644IY#PBF; Pin Count: 77; Case: BGA77; Mounted: Yes; Socket: No; SMD: Yes; Sense: No; ComponentHeight: 5.21mm; HelpURL: \\cern.ch\dfs\Applications\Altium\Datasheets\LTM4644IY#PBF.pdf; Author: CERN DEM JLC; CreateDate: 25.04.2018; LatestRevisionDate: 25.04.2018
R392 R424 R427 R430 = R0603_NO-VALUE: Resistor; Part Description: Reserved Footprint For a 0603 (1608) Chip Resistor; PressFit: No; Mounted: No; Part Number: R0603_NO-VALUE; Component Kind: Standard; Component Type: Standard; Pin Count: 2; Value: Undefined; Status: None; Manufacturer: Undefined; Manufacturer Part Number: R0603_NO-VALUE; Case: 0603; Sense: No; Socket: No; SMD: Yes; Manufacturer1 Example: Undefined; Manufacturer1 Part Number: Undefined; Manufacturer1 ComponentHeight: Undefined; HelpURL: Undefined; Author: CERN DEM JLC; CreateDate: 03.12.2007; LatestRevisionDate: 13.03.2008
R420 R423 R426 R429 R432 = R0402_0R_JUMPER: Resistor; Manufacturer: GENERIC; Part Description: 1A (0.05R Max DC Resistance) Zero Ohm Jumper; Manufacturer1 Part Number: 232270591001L; PressFit: No; Manufacturer Part Number: R0402_0R_JUMPER; Part Number: R0402_0R_JUMPER; Value: 0; Component Kind: Standard; Component Type: Standard; Pin Count: 2; Status: Not Recommended; Case: 0402; Mounted: Yes; Sense: No; Socket: No; SMD: Yes; Manufacturer1 Example: YAGEO PHYCOMP; Manufacturer1 ComponentHeight: 0.4mm; HelpURL: \\cern.ch\dfs\Applications\Altium\Datasheets\R0402_Phycomp_RC0402.pdf; Author: CERN DEM JLC; CreateDate: 03.12.2007; LatestRevisionDate: 17.10.2012
R421 = R0402_10K_1%_0.0625W_100PPM: as R142 on sheet PWR_DC_DC_EXAR; Manufacturer Part Number: R0402_10K_1%_0.0625W_100PPM; Part Number: R0402_10K_1%_0.0625W_100PPM; Tolerance: ±1%; Value: 10k; Component Kind: Standard; Component Type: Standard; Pin Count: 2; Status: Not Recommended; Power: 0.0625W; Case: 0402; Mounted: Yes; Sense: No; Socket: No; SMD: Yes; Manufacturer1 Example: YAGEO PHYCOMP; Manufacturer1 ComponentHeight: 0.4mm; HelpURL: \\cern.ch\dfs\Applications\Altium\Datasheets\R0402_Phycomp_RC0402.pdf; Author: CERN DEM JLC; CreateDate: 03.12.2007; LatestRevisionDate: 17.10.2012
R422 = R0603_90K9_1%_0.1W_100PPM: Resistor - 1%; Part Description: General Purpose Thick Film Chip Resistor; Manufacturer: GENERIC; Manufacturer1 Part Number: CRCW060390K9FKEA; Power: 0.1W; TC: ±100ppm/°C; PressFit: No; Part Number: R0603_90K9_1%_0.1W_100PPM; Component Kind: Standard; Component Type: Standard; Pin Count: 2; Value: 90k9; Status: Preferred; Tolerance: ±1%; Manufacturer Part Number: R0603_90K9_1%_0.1W_100PPM; Case: 0603; Mounted: Yes; Sense: No; Socket: No; SMD: Yes; Manufacturer1 Example: VISHAY; Manufacturer1 ComponentHeight: 0.55mm; HelpURL: \\cern.ch\dfs\Applications\Altium\Datasheets\R0603_VISHAY_CRCW e3.pdf; Author: CERN DEM JLC; CreateDate: 14.03.2018; LatestRevisionDate: 14.03.2018
R425 = R0603_40K2_0.1%_0.063W_10PPM: Resistor - 0.1%; Part Description: Thin Film Chip Resistor; Manufacturer: GENERIC; Manufacturer1 Part Number: RN73C1J40K2BTDF; Power: 0.063W; TC: ±10ppm; PressFit: No; Part Number: R0603_40K2_0.1%_0.063W_10PPM; Component Kind: Standard; Component Type: Standard; Pin Count: 2; Value: 40k2; Status: Not Recommended; Tolerance: ±0.1%; Manufacturer Part Number: R0603_40K2_0.1%_0.063W_10PPM; Case: 0603; Mounted: Yes; Sense: No; Socket: No; SMD: Yes; Manufacturer1 Example: TYCO HOLSWORTHY; Manufacturer1 ComponentHeight: 0.5mm; HelpURL: \\cern.ch\dfs\Applications\Altium\Datasheets\R0603_Tyco_RN73.pdf; Author: CERN DEM JLC; CreateDate: 03.12.2007; LatestRevisionDate: 13.03.2008
R428 = R0603_13K3_0.1%_0.063W_10PPM: Resistor - 0.1%; Part Description: Thin Film Chip Resistor; Manufacturer: GENERIC; Manufacturer1 Part Number: RN73C1J13K3BTDF; Power: 0.063W; TC: ±10ppm; PressFit: No; Part Number: R0603_13K3_0.1%_0.063W_10PPM; Component Kind: Standard; Component Type: Standard; Pin Count: 2; Value: 13k3; Status: Not Recommended; Tolerance: ±0.1%; Manufacturer Part Number: R0603_13K3_0.1%_0.063W_10PPM; Case: 0603; Mounted: Yes; Sense: No; Socket: No; SMD: Yes; Manufacturer1 Example: TYCO HOLSWORTHY; Manufacturer1 ComponentHeight: 0.5mm; HelpURL: \\cern.ch\dfs\Applications\Altium\Datasheets\R0603_Tyco_RN73.pdf; Author: CERN DEM JLC; CreateDate: 03.12.2007; LatestRevisionDate: 13.03.2008
R431 = R0603_30K1_0.1%_0.063W_10PPM: Resistor - 0.1%; Part Description: Thin Film Chip Resistor; Manufacturer: GENERIC; Manufacturer1 Part Number: RN73C1J30K1BTDF; Power: 0.063W; TC: ±10ppm; PressFit: No; Part Number: R0603_30K1_0.1%_0.063W_10PPM; Component Kind: Standard; Component Type: Standard; Pin Count: 2; Value: 30k1; Status: Not Recommended; Tolerance: ±0.1%; Manufacturer Part Number: R0603_30K1_0.1%_0.063W_10PPM; Case: 0603; Mounted: Yes; Sense: No; Socket: No; SMD: Yes; Manufacturer1 Example: TYCO HOLSWORTHY; Manufacturer1 ComponentHeight: 0.5mm; HelpURL: \\cern.ch\dfs\Applications\Altium\Datasheets\R0603_Tyco_RN73.pdf; Author: CERN DEM JLC; CreateDate: 03.12.2007; LatestRevisionDate: 13.03.2008
TP23-TP30 = TP: Testpoint

## Sheet MCH_CON.SchDoc: Metlino
size 420 x 297 mm; CheckedBy: P.Kulik,T.Przywozki,W.Ruclo; Author: G.Kasprowicz; CompanyName: WUT ISE; DrawnBy: G.Kasprowicz; Organization: WUT ISE; Address1: PW ISE; Address2: Nowowiejska 15/19 00-665 Warsaw; Address3: gkasprow@gmail.com; DocumentNumber: 15; Revision: 2; SheetNumber: 15; SheetTotal: 29; ModifiedBy: -; CheckedDate: -; Title2: MCH Tongue 3&4 connectors; DivGrp: WUT ISE; Designer: G.Kasprowicz; ModifiedDate: -; ProjectName: Sensor Box
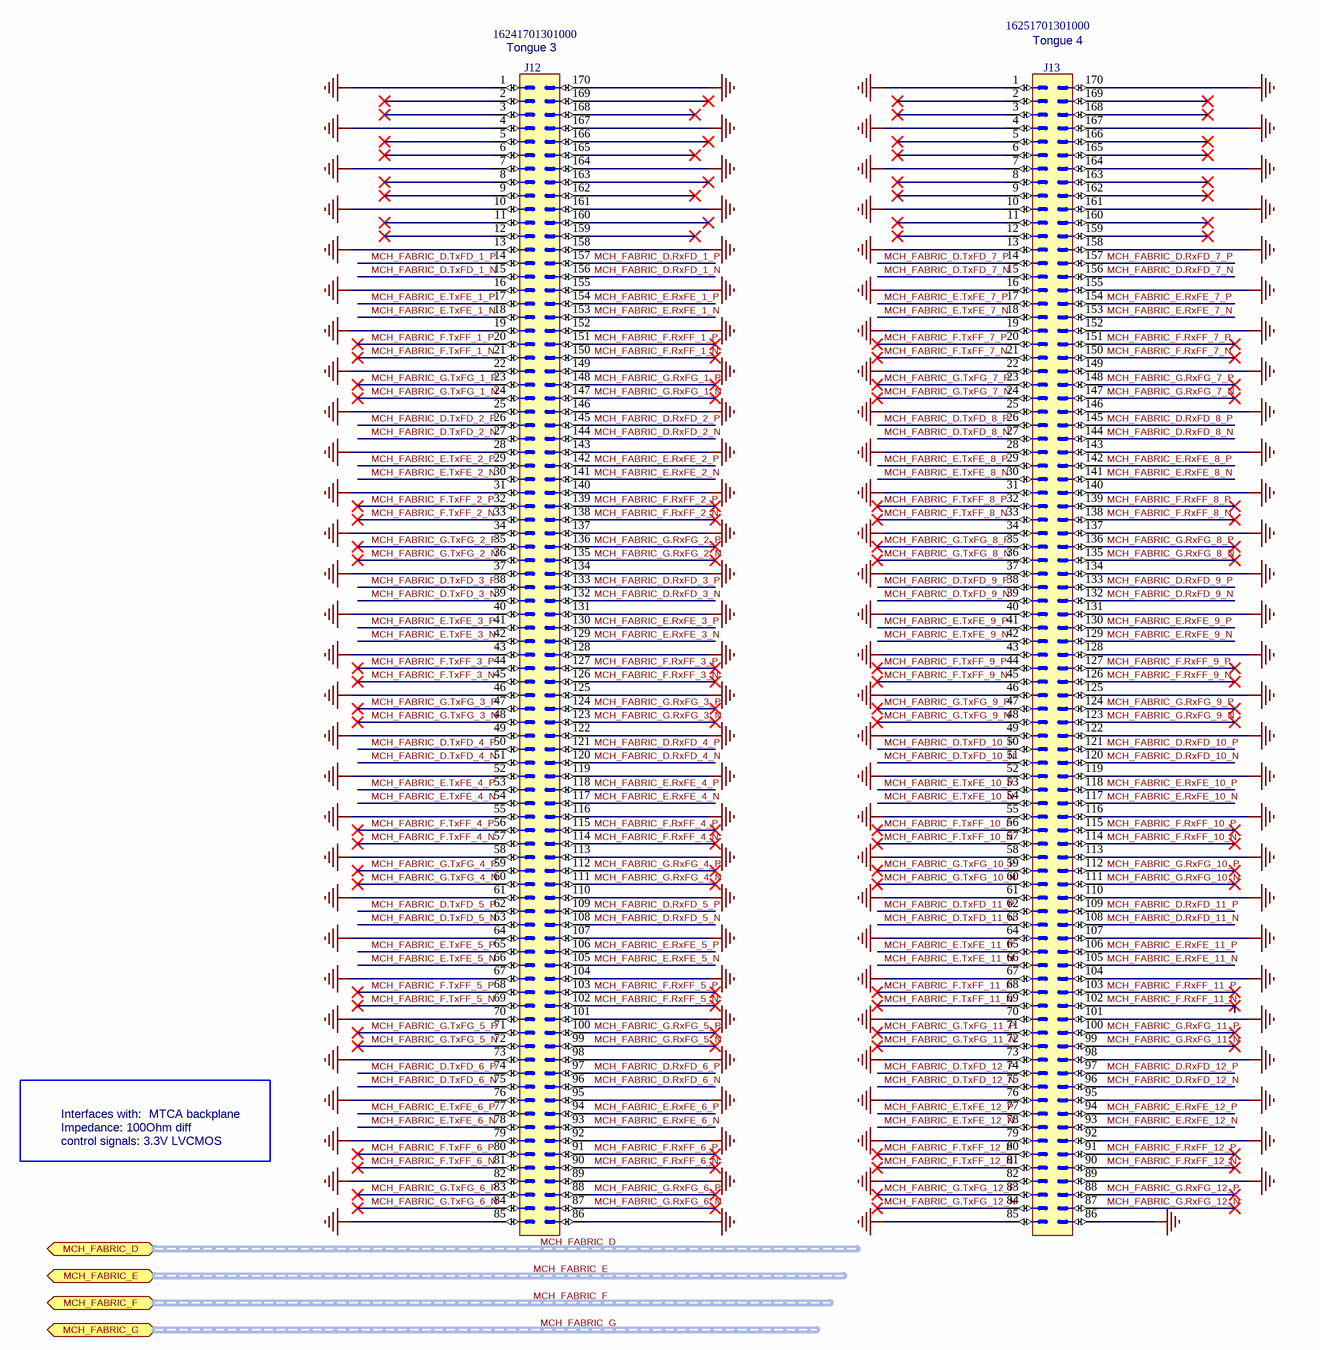
[diagram p12: MCH_CON.SchDoc]

### Parts
J12  Manufacturer Part Number: 16241701301000  [ITB_16241701301000]  (hidden comment: AdvancedMC)
J13  Manufacturer Part Number: 16251701301000  [ITB_16251701301000]  (hidden comment: AdvancedMC)

### Ports
MCH_FABRIC_D (bidir, harness MCH_FABRIC_D), MCH_FABRIC_E (bidir, harness MCH_FABRIC_E), MCH_FABRIC_F (bidir, harness MCH_FABRIC_F), MCH_FABRIC_G (bidir, harness MCH_FABRIC_G)

### Nets
GND: J12.1 J12.4 J12.7 J12.10 J12.13 J12.16 J12.19 J12.22 J12.25 J12.28 J12.31 J12.34 J12.37 J12.40 J12.43 J12.46 J12.49 J12.52 J12.55 J12.58 J12.61 J12.64 J12.67 J12.70 J12.73 J12.76 J12.79 J12.82 J12.85 J12.86 J12.89 J12.92 J12.95 J12.98 J12.101 J12.104 J12.107 J12.110 J12.113 J12.116 J12.119 J12.122 J12.125 J12.128 J12.131 J12.134 J12.137 J12.140 J12.143 J12.146 J12.149 J12.152 J12.155 J12.158 J12.161 J12.164 J12.167 J12.170 J13.1 J13.4 J13.7 J13.10 J13.13 J13.16 J13.19 J13.22 J13.25 J13.28 J13.31 J13.34 J13.37 J13.40 J13.43 J13.46 J13.49 J13.52 J13.55 J13.58 J13.61 J13.64 J13.67 J13.70 J13.73 J13.76 J13.79 J13.82 J13.85 J13.86 J13.89 J13.92 J13.95 J13.98 J13.101 J13.104 J13.107 J13.110 J13.113 J13.116 J13.119 J13.122 J13.125 J13.128 J13.131 J13.134 J13.137 J13.140 J13.143 J13.146 J13.149 J13.152 J13.155 J13.158 J13.161 J13.164 J13.167 J13.170
MCH_FABRIC_D.RxFD_1_N: J12.156
MCH_FABRIC_D.RxFD_1_P: J12.157
MCH_FABRIC_D.RxFD_2_N: J12.144
MCH_FABRIC_D.RxFD_2_P: J12.145
MCH_FABRIC_D.RxFD_3_N: J12.132
MCH_FABRIC_D.RxFD_3_P: J12.133
MCH_FABRIC_D.RxFD_4_N: J12.120
MCH_FABRIC_D.RxFD_4_P: J12.121
MCH_FABRIC_D.RxFD_5_N: J12.108
MCH_FABRIC_D.RxFD_5_P: J12.109
MCH_FABRIC_D.RxFD_6_N: J12.96
MCH_FABRIC_D.RxFD_6_P: J12.97
MCH_FABRIC_D.RxFD_7_N: J13.156
MCH_FABRIC_D.RxFD_7_P: J13.157
MCH_FABRIC_D.RxFD_8_N: J13.144
MCH_FABRIC_D.RxFD_8_P: J13.145
MCH_FABRIC_D.RxFD_9_N: J13.132
MCH_FABRIC_D.RxFD_9_P: J13.133
MCH_FABRIC_D.RxFD_10_N: J13.120
MCH_FABRIC_D.RxFD_10_P: J13.121
MCH_FABRIC_D.RxFD_11_N: J13.108
MCH_FABRIC_D.RxFD_11_P: J13.109
MCH_FABRIC_D.RxFD_12_N: J13.96
MCH_FABRIC_D.RxFD_12_P: J13.97
MCH_FABRIC_D.TxFD_1_N: J12.15
MCH_FABRIC_D.TxFD_1_P: J12.14
MCH_FABRIC_D.TxFD_2_N: J12.27
MCH_FABRIC_D.TxFD_2_P: J12.26
MCH_FABRIC_D.TxFD_3_N: J12.39
MCH_FABRIC_D.TxFD_3_P: J12.38
MCH_FABRIC_D.TxFD_4_N: J12.51
MCH_FABRIC_D.TxFD_4_P: J12.50
MCH_FABRIC_D.TxFD_5_N: J12.63
MCH_FABRIC_D.TxFD_5_P: J12.62
MCH_FABRIC_D.TxFD_6_N: J12.75
MCH_FABRIC_D.TxFD_6_P: J12.74
MCH_FABRIC_D.TxFD_7_N: J13.15
MCH_FABRIC_D.TxFD_7_P: J13.14
MCH_FABRIC_D.TxFD_8_N: J13.27
MCH_FABRIC_D.TxFD_8_P: J13.26
MCH_FABRIC_D.TxFD_9_N: J13.39
MCH_FABRIC_D.TxFD_9_P: J13.38
MCH_FABRIC_D.TxFD_10_N: J13.51
MCH_FABRIC_D.TxFD_10_P: J13.50
MCH_FABRIC_D.TxFD_11_N: J13.63
MCH_FABRIC_D.TxFD_11_P: J13.62
MCH_FABRIC_D.TxFD_12_N: J13.75
MCH_FABRIC_D.TxFD_12_P: J13.74
MCH_FABRIC_E.RxFE_1_N: J12.153
MCH_FABRIC_E.RxFE_1_P: J12.154
MCH_FABRIC_E.RxFE_2_N: J12.141
MCH_FABRIC_E.RxFE_2_P: J12.142
MCH_FABRIC_E.RxFE_3_N: J12.129
MCH_FABRIC_E.RxFE_3_P: J12.130
MCH_FABRIC_E.RxFE_4_N: J12.117
MCH_FABRIC_E.RxFE_4_P: J12.118
MCH_FABRIC_E.RxFE_5_N: J12.105
MCH_FABRIC_E.RxFE_5_P: J12.106
MCH_FABRIC_E.RxFE_6_N: J12.93
MCH_FABRIC_E.RxFE_6_P: J12.94
MCH_FABRIC_E.RxFE_7_N: J13.153
MCH_FABRIC_E.RxFE_7_P: J13.154
MCH_FABRIC_E.RxFE_8_N: J13.141
MCH_FABRIC_E.RxFE_8_P: J13.142
MCH_FABRIC_E.RxFE_9_N: J13.129
MCH_FABRIC_E.RxFE_9_P: J13.130
MCH_FABRIC_E.RxFE_10_N: J13.117
MCH_FABRIC_E.RxFE_10_P: J13.118
MCH_FABRIC_E.RxFE_11_N: J13.105
MCH_FABRIC_E.RxFE_11_P: J13.106
MCH_FABRIC_E.RxFE_12_N: J13.93
MCH_FABRIC_E.RxFE_12_P: J13.94
MCH_FABRIC_E.TxFE_1_N: J12.18
MCH_FABRIC_E.TxFE_1_P: J12.17
MCH_FABRIC_E.TxFE_2_N: J12.30
MCH_FABRIC_E.TxFE_2_P: J12.29
MCH_FABRIC_E.TxFE_3_N: J12.42
MCH_FABRIC_E.TxFE_3_P: J12.41
MCH_FABRIC_E.TxFE_4_N: J12.54
MCH_FABRIC_E.TxFE_4_P: J12.53
MCH_FABRIC_E.TxFE_5_N: J12.66
MCH_FABRIC_E.TxFE_5_P: J12.65
MCH_FABRIC_E.TxFE_6_N: J12.78
MCH_FABRIC_E.TxFE_6_P: J12.77
MCH_FABRIC_E.TxFE_7_N: J13.18
MCH_FABRIC_E.TxFE_7_P: J13.17
MCH_FABRIC_E.TxFE_8_N: J13.30
MCH_FABRIC_E.TxFE_8_P: J13.29
MCH_FABRIC_E.TxFE_9_N: J13.42
MCH_FABRIC_E.TxFE_9_P: J13.41
MCH_FABRIC_E.TxFE_10_N: J13.54
MCH_FABRIC_E.TxFE_10_P: J13.53
MCH_FABRIC_E.TxFE_11_N: J13.66
MCH_FABRIC_E.TxFE_11_P: J13.65
MCH_FABRIC_E.TxFE_12_N: J13.78
MCH_FABRIC_E.TxFE_12_P: J13.77
MCH_FABRIC_F.RxFF_1_N: J12.150
MCH_FABRIC_F.RxFF_1_P: J12.151
MCH_FABRIC_F.RxFF_2_N: J12.138
MCH_FABRIC_F.RxFF_2_P: J12.139
MCH_FABRIC_F.RxFF_3_N: J12.126
MCH_FABRIC_F.RxFF_3_P: J12.127
MCH_FABRIC_F.RxFF_4_N: J12.114
MCH_FABRIC_F.RxFF_4_P: J12.115
MCH_FABRIC_F.RxFF_5_N: J12.102
MCH_FABRIC_F.RxFF_5_P: J12.103
MCH_FABRIC_F.RxFF_6_N: J12.90
MCH_FABRIC_F.RxFF_6_P: J12.91
MCH_FABRIC_F.RxFF_7_N: J13.150
MCH_FABRIC_F.RxFF_7_P: J13.151
MCH_FABRIC_F.RxFF_8_N: J13.138
MCH_FABRIC_F.RxFF_8_P: J13.139
MCH_FABRIC_F.RxFF_9_N: J13.126
MCH_FABRIC_F.RxFF_9_P: J13.127
MCH_FABRIC_F.RxFF_10_N: J13.114
MCH_FABRIC_F.RxFF_10_P: J13.115
MCH_FABRIC_F.RxFF_11_N: J13.102
MCH_FABRIC_F.RxFF_11_P: J13.103
MCH_FABRIC_F.RxFF_12_N: J13.90
MCH_FABRIC_F.RxFF_12_P: J13.91
MCH_FABRIC_F.TxFF_1_N: J12.21
MCH_FABRIC_F.TxFF_1_P: J12.20
MCH_FABRIC_F.TxFF_2_N: J12.33
MCH_FABRIC_F.TxFF_2_P: J12.32
MCH_FABRIC_F.TxFF_3_N: J12.45
MCH_FABRIC_F.TxFF_3_P: J12.44
MCH_FABRIC_F.TxFF_4_N: J12.57
MCH_FABRIC_F.TxFF_4_P: J12.56
MCH_FABRIC_F.TxFF_5_N: J12.69
MCH_FABRIC_F.TxFF_5_P: J12.68
MCH_FABRIC_F.TxFF_6_N: J12.81
MCH_FABRIC_F.TxFF_6_P: J12.80
MCH_FABRIC_F.TxFF_7_N: J13.21
MCH_FABRIC_F.TxFF_7_P: J13.20
MCH_FABRIC_F.TxFF_8_N: J13.33
MCH_FABRIC_F.TxFF_8_P: J13.32
MCH_FABRIC_F.TxFF_9_N: J13.45
MCH_FABRIC_F.TxFF_9_P: J13.44
MCH_FABRIC_F.TxFF_10_N: J13.57
MCH_FABRIC_F.TxFF_10_P: J13.56
MCH_FABRIC_F.TxFF_11_N: J13.69
MCH_FABRIC_F.TxFF_11_P: J13.68
MCH_FABRIC_F.TxFF_12_N: J13.81
MCH_FABRIC_F.TxFF_12_P: J13.80
MCH_FABRIC_G.RxFG_1_N: J12.147
MCH_FABRIC_G.RxFG_1_P: J12.148
MCH_FABRIC_G.RxFG_2_N: J12.135
MCH_FABRIC_G.RxFG_2_P: J12.136
MCH_FABRIC_G.RxFG_3_N: J12.123
MCH_FABRIC_G.RxFG_3_P: J12.124
MCH_FABRIC_G.RxFG_4_N: J12.111
MCH_FABRIC_G.RxFG_4_P: J12.112
MCH_FABRIC_G.RxFG_5_N: J12.99
MCH_FABRIC_G.RxFG_5_P: J12.100
MCH_FABRIC_G.RxFG_6_N: J12.87
MCH_FABRIC_G.RxFG_6_P: J12.88
MCH_FABRIC_G.RxFG_7_N: J13.147
MCH_FABRIC_G.RxFG_7_P: J13.148
MCH_FABRIC_G.RxFG_8_N: J13.135
MCH_FABRIC_G.RxFG_8_P: J13.136
MCH_FABRIC_G.RxFG_9_N: J13.123
MCH_FABRIC_G.RxFG_9_P: J13.124
MCH_FABRIC_G.RxFG_10_N: J13.111
MCH_FABRIC_G.RxFG_10_P: J13.112
MCH_FABRIC_G.RxFG_11_N: J13.99
MCH_FABRIC_G.RxFG_11_P: J13.100
MCH_FABRIC_G.RxFG_12_N: J13.87
MCH_FABRIC_G.RxFG_12_P: J13.88
MCH_FABRIC_G.TxFG_1_N: J12.24
MCH_FABRIC_G.TxFG_1_P: J12.23
MCH_FABRIC_G.TxFG_2_N: J12.36
MCH_FABRIC_G.TxFG_2_P: J12.35
MCH_FABRIC_G.TxFG_3_N: J12.48
MCH_FABRIC_G.TxFG_3_P: J12.47
MCH_FABRIC_G.TxFG_4_N: J12.60
MCH_FABRIC_G.TxFG_4_P: J12.59
MCH_FABRIC_G.TxFG_5_N: J12.72
MCH_FABRIC_G.TxFG_5_P: J12.71
MCH_FABRIC_G.TxFG_6_N: J12.84
MCH_FABRIC_G.TxFG_6_P: J12.83
MCH_FABRIC_G.TxFG_7_N: J13.24
MCH_FABRIC_G.TxFG_7_P: J13.23
MCH_FABRIC_G.TxFG_8_N: J13.36
MCH_FABRIC_G.TxFG_8_P: J13.35
MCH_FABRIC_G.TxFG_9_N: J13.48
MCH_FABRIC_G.TxFG_9_P: J13.47
MCH_FABRIC_G.TxFG_10_N: J13.60
MCH_FABRIC_G.TxFG_10_P: J13.59
MCH_FABRIC_G.TxFG_11_N: J13.72
MCH_FABRIC_G.TxFG_11_P: J13.71
MCH_FABRIC_G.TxFG_12_N: J13.84
MCH_FABRIC_G.TxFG_12_P: J13.83

Not connected (* = marked no-connect by the designer): J12 2(3)* 3(5)* 5(9)* 6(11)* 8(15)* 9(17)* 11(21)* 12(23)* 159* 160* 162* 163* 165* 166* 168* 169*; J13 2(3)* 3(5)* 5(9)* 6(11)* 8(15)* 9(17)* 11(21)* 12(23)* 159* 160* 162* 163* 165* 166* 168* 169*

### Buses and harness runs
harness MCH_FABRIC_D = port MCH_FABRIC_D
harness MCH_FABRIC_E = port MCH_FABRIC_E
harness MCH_FABRIC_F = port MCH_FABRIC_F
harness MCH_FABRIC_G = port MCH_FABRIC_G

### Notes on the sheet
- (near J12) Tongue 3
- (near J13) Tongue 4
- Interfaces with:
- MTCA backplane
- control signals: 3.3V LVCMOS
- Impedance: 100Ohm diff
- Project/Equipment
- Document
- Designer
- Drawn by
- Check.by
- Copyright WUT ISE 2018.
  This documentation describes Open Hardware and is licensed under the CERN OHL v.1.1. You may redistribute and modify this documentation under the terms of the CERN OHL v.1.1. (http://ohwr.org/CERNOHL). This documentation is distributed WITHOUT ANY EXPRESS OR IMPLIED WARRANTY, INCLUDING OF MERCHANTABILITY, SATISFACTORY QUALITY AND FITNESS FOR A PARTICULAR PURPOSE. Please see the CERN OHL v.1.1 for applicable conditions.
- Contact
- File
- Last Mod.
- Print Date
- Sheet
- Size
- A3
- of
- Rev

### Library data of the parts
J12 = ITB_16241701301000: Connector 170 Male; Manufacturer: ITB ADVANCED CONNECTORS; Part Description: 170 Poles, MCH-Plug Connector (Basic Side); PressFit: No; Part Number: ITB_16241701301000; Component Kind: Standard; Component Type: Standard; Pin Count: 170; Family: AdvancedMC; Mounted: Yes; Socket: No; SMD: No; Sense: No; Status: None; ComponentHeight: 7.63mm; HelpURL: \\cern.ch\dfs\Applications\Altium\Datasheets\ITB_16241701301000.pdf; Author: CERN DEM MR; CreateDate: 17.05.2016; LatestRevisionDate: 17.05.2016
J13 = ITB_16251701301000: Connector 170 Male; Manufacturer: ITB ADVANCED CONNECTORS; Part Description: 170 Poles, Piggyback Plug Connector (Basic Side); PressFit: No; Part Number: ITB_16251701301000; Component Kind: Standard; Component Type: Standard; Pin Count: 170; Family: AdvancedMC; Mounted: Yes; Socket: No; SMD: No; Sense: No; Status: None; ComponentHeight: 7.64mm; HelpURL: \\cern.ch\dfs\Applications\Altium\Datasheets\ITB_16251701301000.pdf; Author: CERN DEM MR; CreateDate: 17.05.2016; LatestRevisionDate: 17.05.2016